# EAGLE design adns_9500_board (EAGLE 5.06)
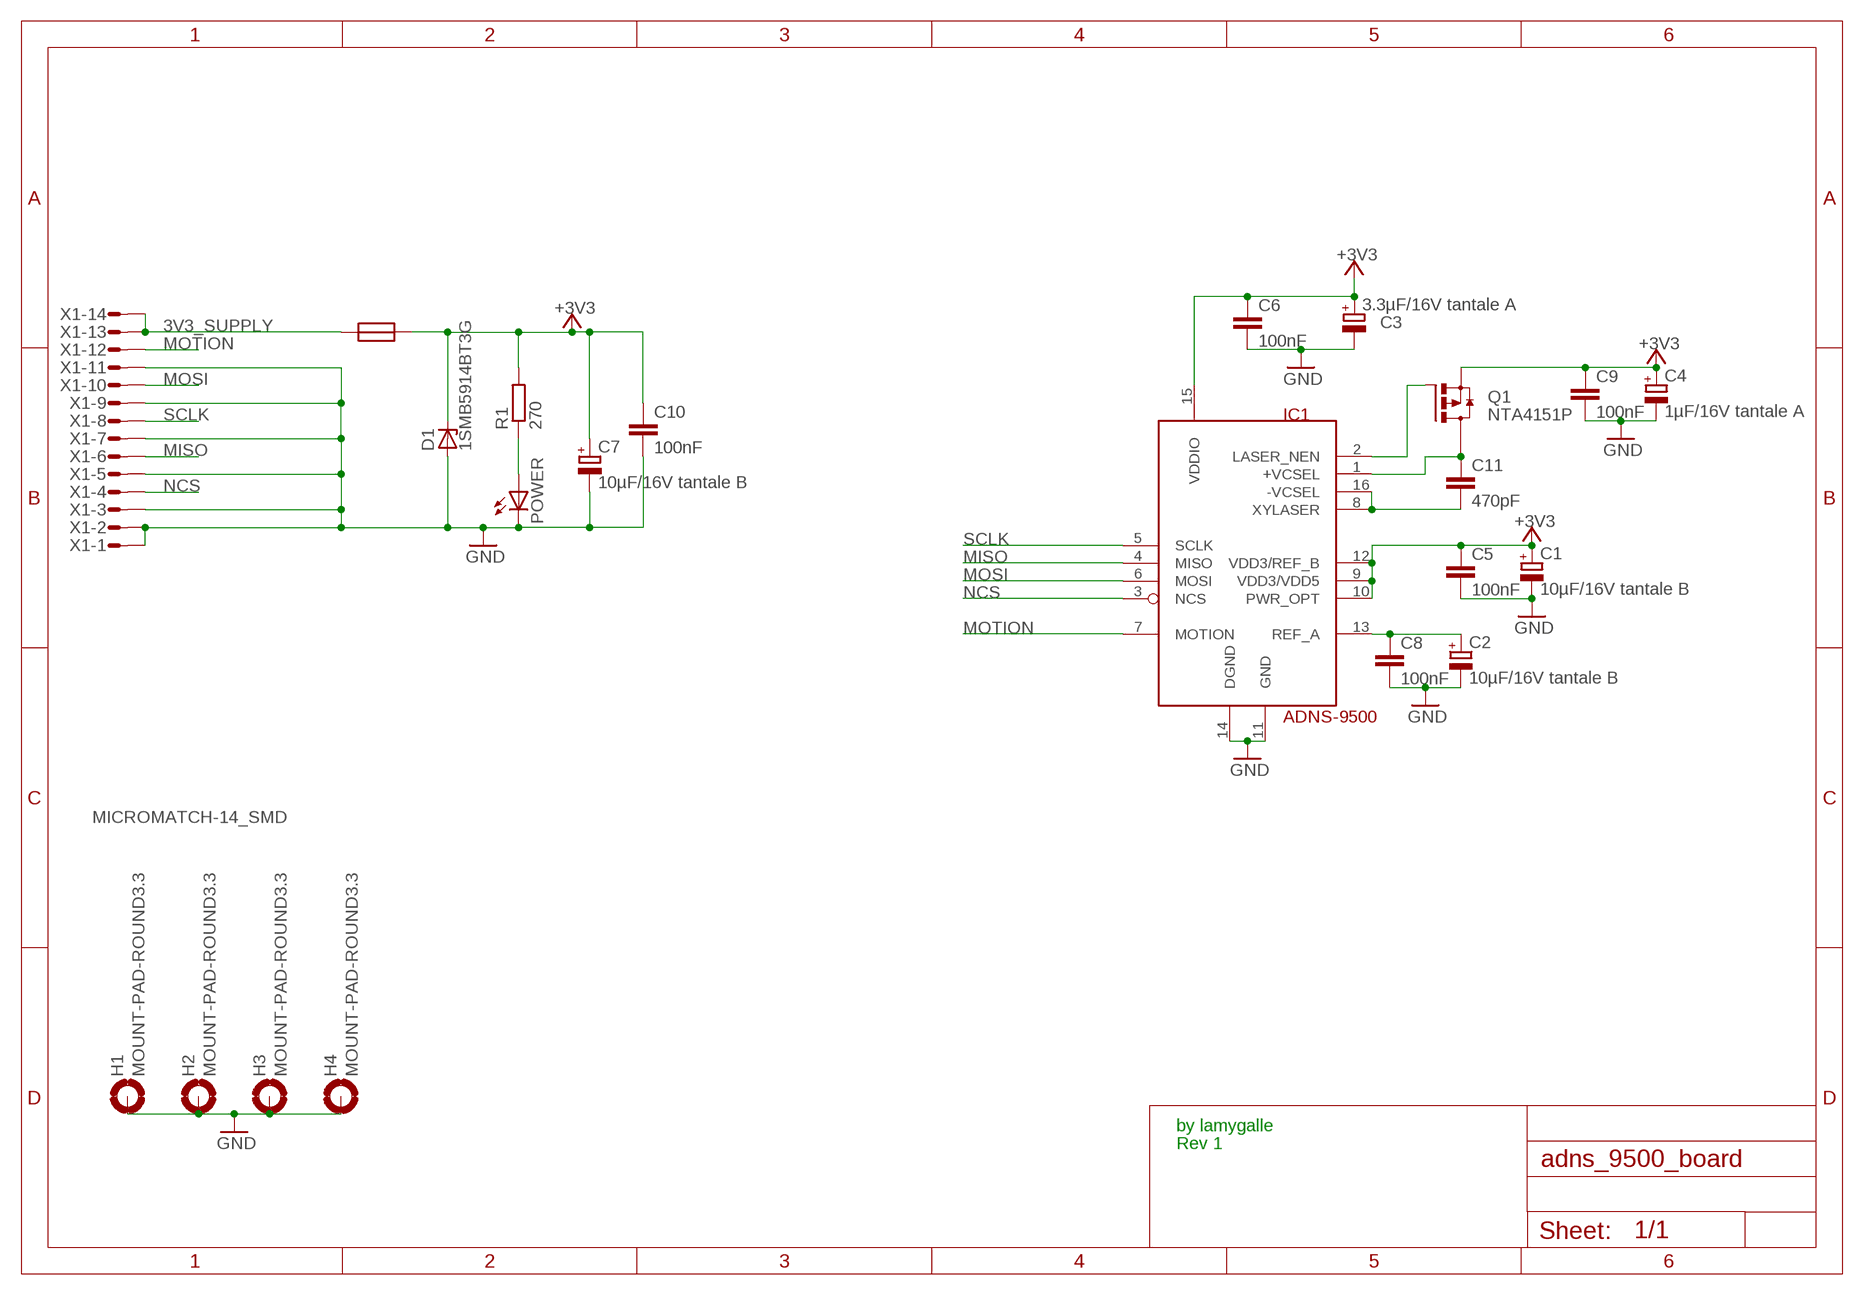
[diagram p0: schematic, sheet 1]

## Parts
C1  10µF/16V tantale B  CPOL-EUSMCB  [SMC_B]
C2  10µF/16V tantale B  CPOL-EUSMCB  [SMC_B]
C3  3.3µF/16V tantale A  CPOL-EUSMCA  [SMC_A]
C4  1µF/16V tantale A  CPOL-EUSMCA  [SMC_A]
C5  100nF  C-EUC0805  [C0805]
C6  100nF  C-EUC0805  [C0805]
C7  10µF/16V tantale B  CPOL-EUSMCB  [SMC_B]
C8  100nF  C-EUC0805  [C0805]
C9  100nF  C-EUC0805  [C0805]
C10  100nF  C-EUC0805  [C0805]
C11  470pF  C-EUC0805  [C0805]
D1  1SMB5914BT3G  ZENER-DIODESMB  [SMB]
F1  FN 1596988  FUSE_1206  [R1206]
H1  MOUNT-PAD-ROUND3.3  [3,3-PAD]
H2  MOUNT-PAD-ROUND3.3  [3,3-PAD]
H3  MOUNT-PAD-ROUND3.3  [3,3-PAD]
H4  MOUNT-PAD-ROUND3.3  [3,3-PAD]
IC1  ADNS-9500  [ADNS-9500]
POWER  LEDCHIPLED_1206  [CHIPLED_1206]
Q1  NTA4151P  [SC-75]
R1  270  R-EU_R0805  [R0805]
X1  MICROMATCH-14_SMD  [MICROMATCH-14]

## Nets
3V3_SUPPLY: F1.1 X1.13 X1.14
+3V3: C1.+ C3.+ C4.+ C5.1 C6.1 C7.+ C9.1 C10.1 D1.C F1.2 IC1.9(VDD3/VDD5) IC1.10(PWR_OPT) IC1.12(VDD3/REF_B) IC1.15(VDDIO) Q1.2(S) R1.2
GND: C1.- C2.- C3.- C4.- C5.2 C6.2 C7.- C8.2 C9.2 C10.2 D1.A H1.B3,3(MOUNT) H2.B3,3(MOUNT) H3.B3,3(MOUNT) H4.B3,3(MOUNT) IC1.11(GND) IC1.14(DGND) POWER.C X1.1 X1.2 X1.3 X1.5 X1.7 X1.9 X1.11
MISO: IC1.4(MISO) X1.6
MOSI: IC1.6(MOSI) X1.10
MOTION: IC1.7(MOTION) X1.12
N$6: C11.1 IC1.1(+VCSEL) Q1.3(D)
N$7: C2.+ C8.1 IC1.13(REF_A)
N$9: IC1.2(LASER_NEN) Q1.1(G)
N$10: C11.2 IC1.8(XYLASER) IC1.16(-VCSEL)
N$11: POWER.A R1.1
NCS: IC1.3(NCS) X1.4
SCLK: IC1.5(SCLK) X1.8

## Notes on the sheet
- by lamygalle
- Rev 1

## Library data of the parts
C1-C4 C7 = rcl:CPOL-EU: POLARIZED CAPACITOR, European symbol
C5 C6 C8-C11 = rcl:C-EU: CAPACITOR, European symbol
D1 = diode:ZENER-DIODE: Z-Diode
F1 = robotter:FUSE_1206
H1-H4 = holes:MOUNT-PAD-ROUND: MOUNTING PAD, round
IC1 = robotter:ADNS-9500
POWER = led:LED: LED OSRAM: - CHIPLED LG R971, LG N971, LY N971, LG Q971, LY Q971, LO R971, LY R971 LH N974, LH R974 LS Q976, LO Q976, LY Q976 LO Q996 - Hyper CHIPLED LW Q18S LB Q993, LB Q99A, LB R99A - SideLED LS A670, LO A670, LY A670, LG A670, LP A670 LB A673, LV A673, LT A673, LW A673 LH A674 LY A675 LS A676, LA A676, LO A676, LY A676, LW A676 LS A679, LY A679, LG A679 - Hyper Micro SIDELED® LS Y876, LA Y876, LO Y876, LY Y876 LT Y87S - SmartLED LW L88C, LW L88S LB L89C, LB L89S, LG L890 LS L89K, LO L89K, LY L89K LS L896, LA L896, LO L896, LY L896 - TOPLED LS T670, LO T670, LY T670, LG T670, LP T670 LSG T670, LSP T670, LSY T670, LOP T670, LYG T670 LG T671, LOG T671, LSG T671 LB T673, LV T673, LT T673, LW T673 LH T674 LS T676, LA T676, LO T676, LY T676, LB T676, LH T676, LSB T676, LW T676 LB T67C, LV T67C, LT T67C, LS T67K, LO T67K, LY T67K, LW E67C LS E67B, LA E67B, LO E67B, LY E67B, LB E67C, LV E67C, LT E67C LW T67C LS T679, LY T679, LG T679 LS T770, LO T770, LY T770, LG T770, LP T770 LB T773, LV T773, LT T773, LW T773 LH T774 LS E675, LA E675, LY E675, LS T675 LS T776, LA T776, LO T776, LY T776, LB T776 LHGB T686 LT T68C, LB T68C - Hyper Mini TOPLED® LB M676 - Mini TOPLED Santana® LG M470 LS M47K, LO M47K, LY M47K Source: http://www.osram.convergy.de LUXEON: - LUMILED® LXK2-PW12-R00, LXK2-PW12-S00, LXK2-PW14-U00, LXK2-PW14-V00 LXK2-PM12-R00, LXK2-PM12-S00, LXK2-PM14-U00 LXK2-PE12-Q00, LXK2-PE12-R00, LXK2-PE12-S00, LXK2-PE14-T00, LXK2-PE14-U00 LXK2-PB12-K00, LXK2-PB12-L00, LXK2-PB12-M00, LXK2-PB14-N00, LXK2-PB14-P00, LXK2-PB14-Q00 LXK2-PR12-L00, LXK2-PR12-M00, LXK2-PR14-Q00, LXK2-PR14-R00 LXK2-PD12-Q00, LXK2-PD12-R00, LXK2-PD12-S00 LXK2-PH12-R00, LXK2-PH12-S00 LXK2-PL12-P00, LXK2-PL12-Q00, LXK2-PL12-R00 Source: www.luxeon.com KINGBRIGHT: KA-3528ASYC Source: www.kingbright.com
Q1 = robotter:NTA4151P
R1 = rcl:R-EU_: RESISTOR, European symbol
X1 = robotter:MICROMATCH-14_SMD: MicroMaTch 14 8-188275-4 / Drawing Number C-188275 DDEController.pdf

## Board
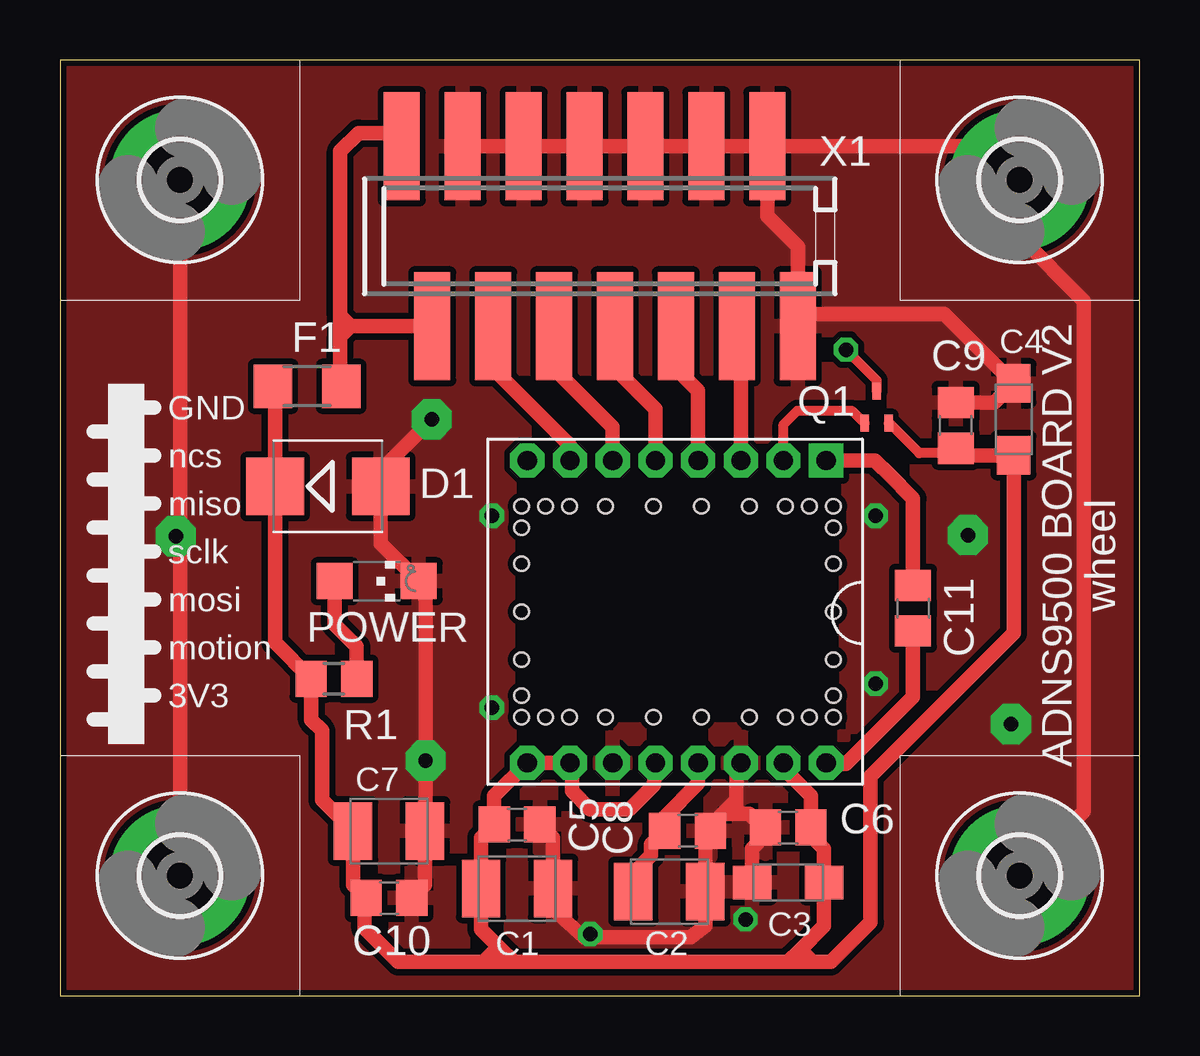
[diagram p1: board, top side]
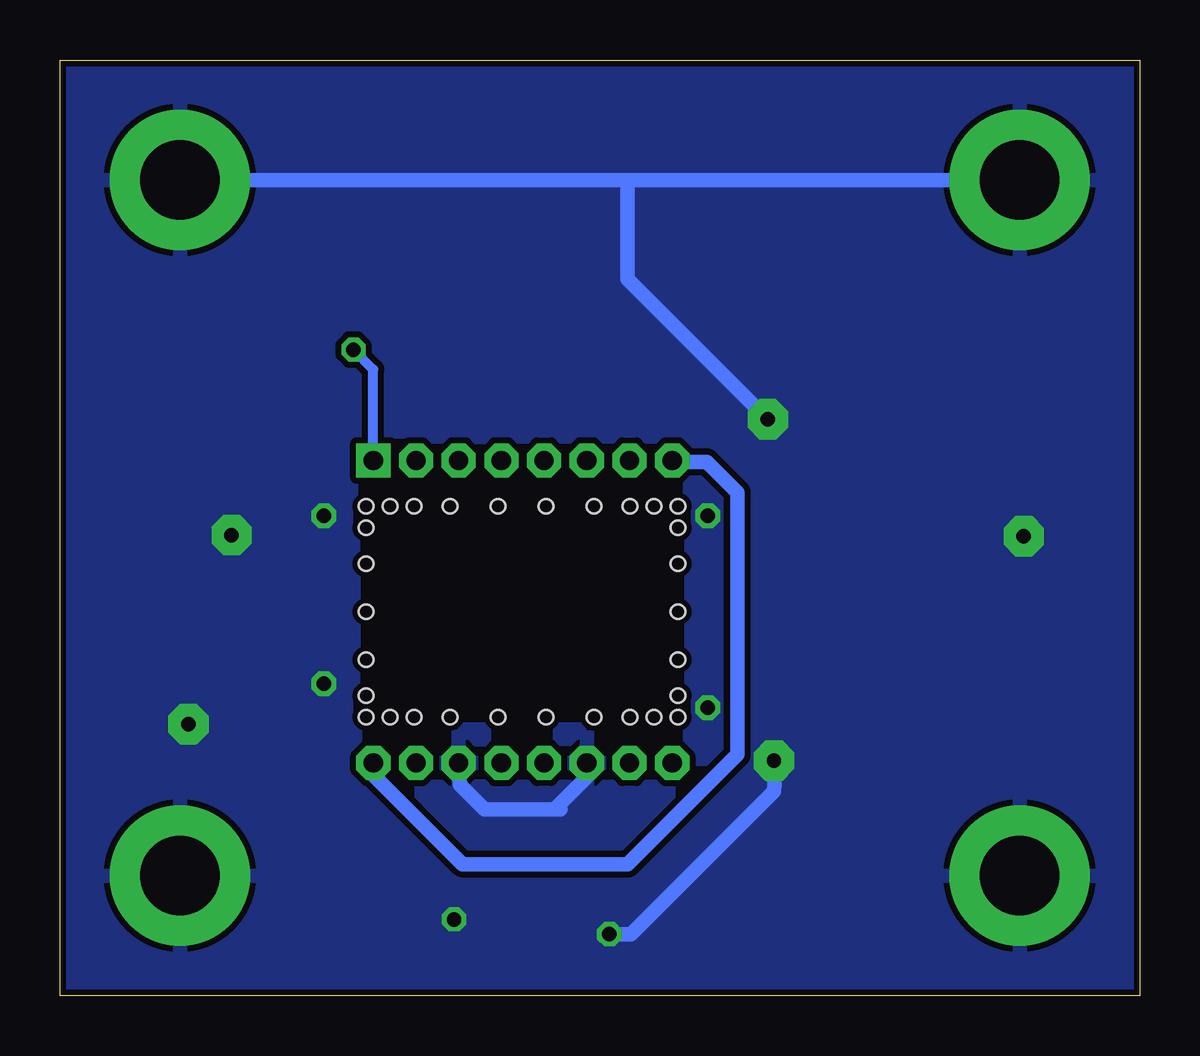
[diagram p2: board, bottom side, seen from below]

Size 45 x 39 mm. Coordinates in mm from the lower left corner, seen from the top.
Outline: 0,0 45,0 45,39 0,39 0,0
Copper layers (1*16): Top 0.035mm / dielectric 1.5mm / Bottom 0.035mm
Design rules "default *": minimum track width 10mil, minimum drill 0.6mm, track to track 10mil, track to pad 10mil, pad to pad 10mil, via to via 10mil, smd to smd 10mil, copper to edge 10mil, drill to drill 10mil, minimum pad ring 10mil, minimum via ring 8mil, stop-mask expansion 4mil, vias tented up to drill 0mil, thermal gap 10mil

### Footprints (pad centres in the part's own frame; a part is rotated, then mirrored left to right if it is on the bottom)
SMC_B = smd 1.6 x 2.4: + -1.5,0; - 1.5,0
SMC_A = smd 1.6 x 1.4: + -1.5,0; - 1.5,0
C0805 = smd 1.3 x 1.5: 1 -0.95,0; 2 0.95,0
SMB = smd 2.4 x 2.4: A 2.2,0; C -2.2,0
R1206 = smd 1.6 x 1.803: 1 -1.422,0; 2 1.422,0
3,3-PAD = drill 3.3 pad 5.842 round: B3,3 0,0
ADNS-9500 = drill 0.8 pad 1.422 square: 1 0,0 | drill 0.8 pad 1.422 octagon: 2 -1.78,0; 3 -3.56,0; 4 -5.34,0; 5 -7.12,0; 6 -8.9,0; 7 -10.68,0; 8 -12.46,0; 9 -12.46,-12.6; 10 -10.68,-12.6; 11 -8.9,-12.6; 12 -7.12,-12.6; 13 -5.34,-12.6; 14 -3.56,-12.6; 15 -1.78,-12.6; 16 0,-12.6 | hole 0.6: -12.7,-1.9; 0.3,-1.9; 0.3,-10.7; -12.7,-10.7; -11.7,-1.9; -10.7,-1.9; -9.2,-1.9; -7.2,-1.9; -5.2,-1.9; -3.2,-1.9; -1.7,-1.9; -0.7,-1.9; -12.7,-2.8; -12.7,-4.3; -12.7,-6.3; 0.3,-6.3; 0.3,-4.3; 0.3,-2.8; -0.7,-10.7; -1.7,-10.7; -3.2,-10.7; -5.2,-10.7; -7.2,-10.7; -9.2,-10.7; -10.7,-10.7; -11.7,-10.7; 0.3,-9.8; 0.3,-8.3; -12.7,-8.3; -12.7,-9.8
CHIPLED_1206 = smd 1.5 x 1.5: A 0,-1.75; C 0,1.75
SC-75 = smd 0.356 x 0.708: 1 -0.5,-0.671; 2 0.5,-0.671; 3 0,0.671
R0805 = smd 1.3 x 1.5: 1 -0.95,0; 2 0.95,0
MICROMATCH-14 = smd 1.5 x 4.5: 1 6.985,3.75; 2 8.255,-3.75; 3 4.445,3.75; 4 5.715,-3.75; 5 1.905,3.75; 6 3.175,-3.75; 7 -0.635,3.75; 8 0.635,-3.75; 9 -3.175,3.75; 10 -1.905,-3.75; 11 -5.715,3.75; 12 -4.445,-3.75; 13 -8.255,3.75; 14 -6.985,-3.75

### Placement (x,y rotation side)
C1  19.05,4.46 0 top
C2  25.4,4.33 0 top
C3  30.35,4.72 180 top
C4  39.75,24.02 90 top
C5  19.05,7.13 0 top
C6  30.35,7 180 top
C7  13.72,6.86 0 top
C8  26.16,6.88 0 top
C9  37.34,23.77 90 top
C10  13.72,4.06 0 top
C11  35.56,16.15 270 top
D1  11.17,21.23 0 top
F1  10.3,25.4 180 top
H1  5,5 0 top
H2  5,34 0 top
H3  40,5 0 top
H4  40,34 0 top
IC1  31.94,22.3 0 top
POWER  13.2,17.27 270 top
Q1  34.04,24.53 0 top
R1  11.42,13.21 180 top
X1  22.5,31.65 0 top

### Tracks (layer width: path | path; a pad name or v marks a point on that pad's centre or on a via)
3V3_SUPPLY
  Top 0.61: 12.12,27.9 11.68,28.34 | 12.12,27.9 11.68,27.46 11.68,25.44 F1.1 | 11.68,28.34 11.68,27.58 | 12.12,27.9 X1.14 | 11.68,28.34 11.68,35.2 12.45,35.96 13.65,35.96 X1.13
+3V3
  Top 0.406: Q1.2 34.56,23.86 35.81,22.61 37.13,22.61 C9.1
  Top 0.61: IC1.12 24.76,8.78 23.75,7.76 22.1,7.76 21.34,8.53 21.34,9.28 IC1.10 IC1.9 18.1,8.32 C5.1 17.55,6.58 C1.+ 17.55,2.77 18.29,2.03 | 18.29,2.03 18.92,1.4 | 30.86,1.91 31.24,1.52 31.11,1.4 30.86,1.4 | 17.65,1.4 18.29,2.03 | F1.2 8.97,24.99 D1.C 8.97,14.71 R1.2 10.47,11.5 10.92,11.05 10.92,8.15 C7.+ 12.22,4.61 C10.1 12.7,4 12.7,2.79 14.1,1.4 17.65,1.4 | C9.1 37.63,22.52 C4.+ 39.75,15.11 33.78,9.14 33.78,3.05 32.13,1.4 30.86,1.4 | 18.92,1.4 30.35,1.4 | 30.35,1.4 30.86,1.4 | 30.35,1.4 30.86,1.91 | 17.65,1.4 18.92,1.4 | 30.86,1.91 31.85,2.9 C3.+ 31.85,6.12 31.5,6.48 31.5,6.81 C6.1 31.3,8.32 30.16,9.46 IC1.15
GND  (via drill 0.6, 0.6 pad 1.02, 0.6 pad 1.68)
  Top 0.61: 27.62,7.57 28.2,8.15 | 27.62,7.57 28.2,7.57 | 28.2,8.15 28.2,7.57 | 28.2,7.57 28.75,7.57 29.34,6.99 C6.2 29.08,6.68 29.08,6.35 28.85,6.12 C3.- | 28.2,8.15 28.2,9.29 IC1.14 | C1.- 20.55,5.44 | X1.1 X1.3 X1.5 X1.7 X1.9 X1.11 | H3.B3,3 42.67,7.67 42.67,28.96 40,31.63 H4.B3,3 38.6,35.4 X1.1 | C9.2 38.95,24.72 C4.- 36.86,28.41 31.2,28.41 30.73,27.94 X1.2 30.75,31.22 29.48,32.49 X1.1 | H1.B3,3 H2.B3,3 | v15.49,24.02 12.87,21.39 D1.A 13.37,18.85 POWER.C 15.24,16.48 v15.24,9.8 15.24,6.88 C7.- 15.22,4.61 C10.2 | C1.- 20.55,3.6 21.84,2.43 26.29,2.43 26.9,2.91 C2.- 26.9,6.54 C8.2 27.11,7.06 27.62,7.57 | C1.- 20.55,6.58 C5.2
  Bottom 0.61: 24.38,7.76 24.13,7.76 | 24.38,7.76 27.3,7.76 28.32,8.78 IC1.14 | IC1.11 23.04,9.11 24.38,7.76 | v15.24,9.8 15.22,9.77 15.22,8.8 15.24,8.51 21.19,2.56 v22.1,2.56 | H2.B3,3 21.34,34 | 21.34,34 H4.B3,3 | v15.49,24.02 21.34,29.86 21.34,34
  other vias: 4.83,19.14 39.64,11.31 37.85,19.19 28.57,3.17 34,20 34,13 18,20 18,12
  pour Bottom: 0,-0.25 45.21,-0.25 45.21,39.12 0,39.12
  pour Top: 0.25,-0.25 45.21,-0.25 45.21,38.86 0.25,38.86
MISO
  Top 0.61: IC1.4 26.6,25.22 25.68,26.14 X1.6
MOSI
  Top 0.61: IC1.6 23.04,23.7 20.59,26.14 X1.10
MOTION
  Top 0.61: IC1.7 21.26,22.94 18.05,26.14 X1.12
N$6  (via drill 0.6)
  Top 0.406: Q1.3 34.04,25.65 v32.77,26.92
  Top 0.61: C11.1 35.56,20.72 34.54,21.73 | 34.54,21.73 34.29,21.99 | IC1.1 33.98,22.3 34.54,21.73
  Bottom 0.406: v32.77,26.92 31.94,26.1 IC1.1
N$7
  Top 0.61: IC1.13 26.6,8.84 25.21,7.45 C8.1 24.64,6.3 24.64,5.84 23.9,5.1 C2.+
N$9
  Top 0.406: IC1.2 30.16,23.81 30.73,24.38 33.01,24.38 Q1.1
N$10
  Top 0.61: IC1.16 31.99,9.65 32.77,9.65 35.56,12.45 C11.2
  Bottom 0.61: IC1.8 19.42,22.24 18.03,22.24 16.76,20.97 16.76,10.05 21.34,5.48 28.21,5.48 31.94,9.21 IC1.16
N$11
  Top 0.61: POWER.A 11.45,15.47 12.37,14.55 R1.1
NCS
  Top 0.61: 27.94,29.16 X1.4 28.38,28.24 IC1.3
SCLK
  Top 0.61: IC1.5 24.82,24.46 23.14,26.14 X1.8

### Text on the board
tPlace: wheel | ADNS9500 BOARD V2
tNames: GND | ncs | miso | sclk | mosi | motion | 3V3
tDocu: optical center is at (24.5 ; 16)